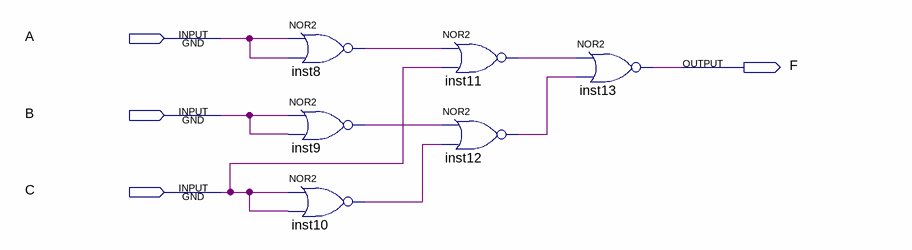
[diagram p0: schematic sheet]
// Quartus schematic tiv1_2.bdf as structural Verilog: 6 symbols, 4 pins
module tiv1_2 (
  input  A,
  input  B,
  input  C,
  output F
);

  wire inst8_out, inst9_out, inst10_out, inst11_out, inst12_out;

  nor inst8 (inst8_out, A, A);
  nor inst9 (inst9_out, B, B);
  nor inst10 (inst10_out, C, C);
  nor inst11 (inst11_out, inst8_out, C);
  nor inst12 (inst12_out, inst9_out, inst10_out);
  nor inst13 (F, inst11_out, inst12_out);
endmodule
